# EAGLE design Team_14_PCB_Ver4.5 (EAGLE 8.3.2)
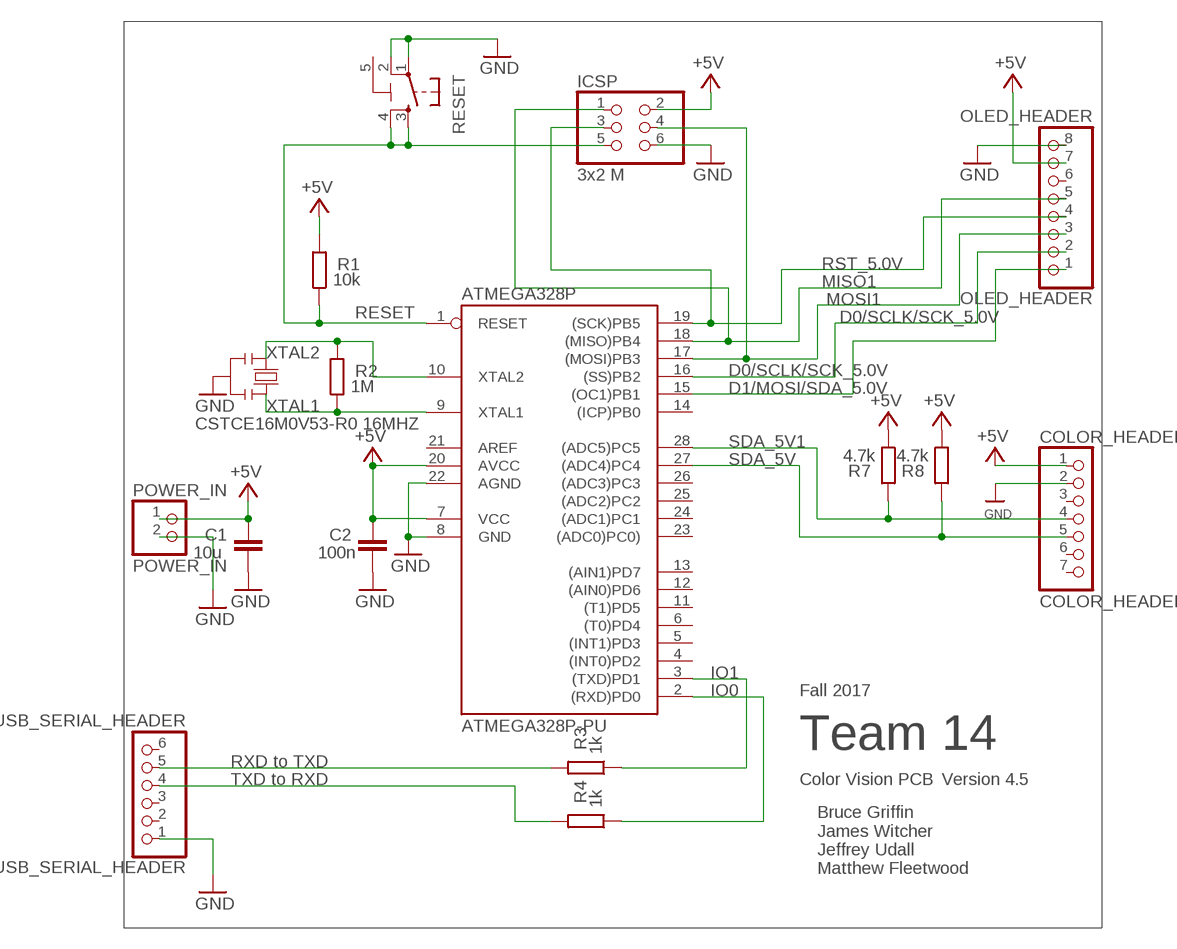
[diagram p0: schematic, sheet 1]

## Parts
ATMEGA328P  ATMEGA328P-PU  [DIL28-3]
C1  10u  C-EU0603-RND  [C0603-ROUND]
C2  100n  C-EU0603-RND  [C0603-ROUND]
COLOR_HEADER  COLOR_HEADER  HEADER-1X770MIL  [1X07_ROUND_70]
ICSP  3x2 M  PINHD-2X3  [2X03]
OLED_HEADER  OLED_HEADER  HEADER-1X870MIL  [1X08_ROUND_70]
POWER_IN  POWER_IN  PINHD-1X2  [1X02]
R1  10k  R-EU_R0603  [R0603-ROUND]
R2  1M  R-EU_R0603  [R0603-ROUND]
R3  1k  R-EU_R0603  [R0603-ROUND]
R4  1k  R-EU_R0603  [R0603-ROUND]
R7  4.7k  R-EU_R0603  [R0603-ROUND]
R8  4.7k  R-EU_R0603  [R0603-ROUND]
RESET  TS42  [TS42]
USB_SERIAL_HEADER  USB_SERIAL_HEADER  PINHD-1X6  [1X06]
Y2  CSTCE16M0V53-R0 16MHZ  RESONATORMU  [RESONATOR]

## Nets
+5V [usbvcc]: ATMEGA328P.7(VCC) ATMEGA328P.20(AVCC) C1.2 C2.2 COLOR_HEADER.1 ICSP.2 OLED_HEADER.7 POWER_IN.1 R1.2 R7.1 R8.1
D0/SCLK/SCK_5.0V: ATMEGA328P.16((SS)PB2) OLED_HEADER.2
D1/MOSI/SDA_5.0V: ATMEGA328P.15((OC1)PB1) OLED_HEADER.1
GND [gnd]: ATMEGA328P.8(GND) ATMEGA328P.22(AGND) C1.1 C2.1 COLOR_HEADER.2 ICSP.6 OLED_HEADER.8 POWER_IN.2 RESET.1 RESET.2 USB_SERIAL_HEADER.1 Y2.2
IO0: ATMEGA328P.2((RXD)PD0) R4.1
IO1: ATMEGA328P.3((TXD)PD1) R3.1
MISO1: ATMEGA328P.18((MISO)PB4) ICSP.1 OLED_HEADER.5
MOSI1: ATMEGA328P.17((MOSI)PB3) ICSP.4 OLED_HEADER.3
N$1: R3.2 USB_SERIAL_HEADER.5
N$2: R4.2 USB_SERIAL_HEADER.4
RESET: ATMEGA328P.1(RESET) ICSP.5 R1.1 RESET.3 RESET.4
RST_5.0V: ATMEGA328P.19((SCK)PB5) ICSP.3 OLED_HEADER.4
SDA_5V: ATMEGA328P.27((ADC4)PC4) COLOR_HEADER.5 R8.2
SDA_5V1: ATMEGA328P.28((ADC5)PC5) COLOR_HEADER.4 R7.2
XTAL1: ATMEGA328P.9(XTAL1) R2.1 Y2.3
XTAL2: ATMEGA328P.10(XTAL2) R2.2 Y2.1
Unconnected: ATMEGA328P.4((INT0)PD2) ATMEGA328P.5((INT1)PD3) ATMEGA328P.6((T0)PD4) ATMEGA328P.11((T1)PD5) ATMEGA328P.12((AIN0)PD6) ATMEGA328P.13((AIN1)PD7) ATMEGA328P.14((ICP)PB0) ATMEGA328P.21(AREF) ATMEGA328P.23((ADC0)PC0)) ATMEGA328P.24((ADC1)PC1) ATMEGA328P.25((ADC2)PC2) ATMEGA328P.26((ADC3)PC3) COLOR_HEADER.3 COLOR_HEADER.6 COLOR_HEADER.7 OLED_HEADER.6 USB_SERIAL_HEADER.2 USB_SERIAL_HEADER.3 USB_SERIAL_HEADER.6

## Notes on the sheet
- Fall 2017
- Team 14
- RXD to TXD
- TXD to RXD | Color Vision PCB | Version 4.5
- Bruce Griffin
  James Witcher
  Jeffrey Udall
  Matthew Fleetwood

## Power pins joined to a net without a drawn wire
5-GND: RESET.5(5-GND)

## Library data of the parts
ATMEGA328P = SmartPrj:ATMEGA328P-: MICROCONTROLLER 4 Kbytes FLASH 128 bytes SRAM 256 bytes EEPROM UART 6-channel 10 bit ADC
C1 C2 = SmartPrj:C-EU: CAPACITOR, European symbol
COLOR_HEADER = microbuilder:HEADER-1X7: PIN HEADER
ICSP = SmartPrj:PINHD-2X3: PIN HEADER
OLED_HEADER = microbuilder:HEADER-1X8: PIN HEADER
POWER_IN = pinhead:PINHD-1X2: PIN HEADER
R1-R4 R7 R8 = SmartPrj:R-EU_: RESISTOR, European symbol
RESET = SmartPrj:TS42: TS42 Dongnan Electronics Tact switch VDC 12V - 50mA
USB_SERIAL_HEADER = adafruit:PINHD-1X6: PIN HEADER
Y2 = SmartPrj:RESONATOR

## Net classes
0 default: width 0.254 mm, drill 0.305 mm, clearance 0.152 mm
1 power: width 0.61 mm, drill 0.61 mm, clearance 0.254 mm
2 gnd: width 0.305 mm, drill 0.559 mm, clearance 0.254 mm
3 usbvcc: width 0.508 mm, drill 0.61 mm, clearance 0.254 mm
4 aref: width 0.406 mm, drill 0.61 mm, clearance 0.254 mm

## Board
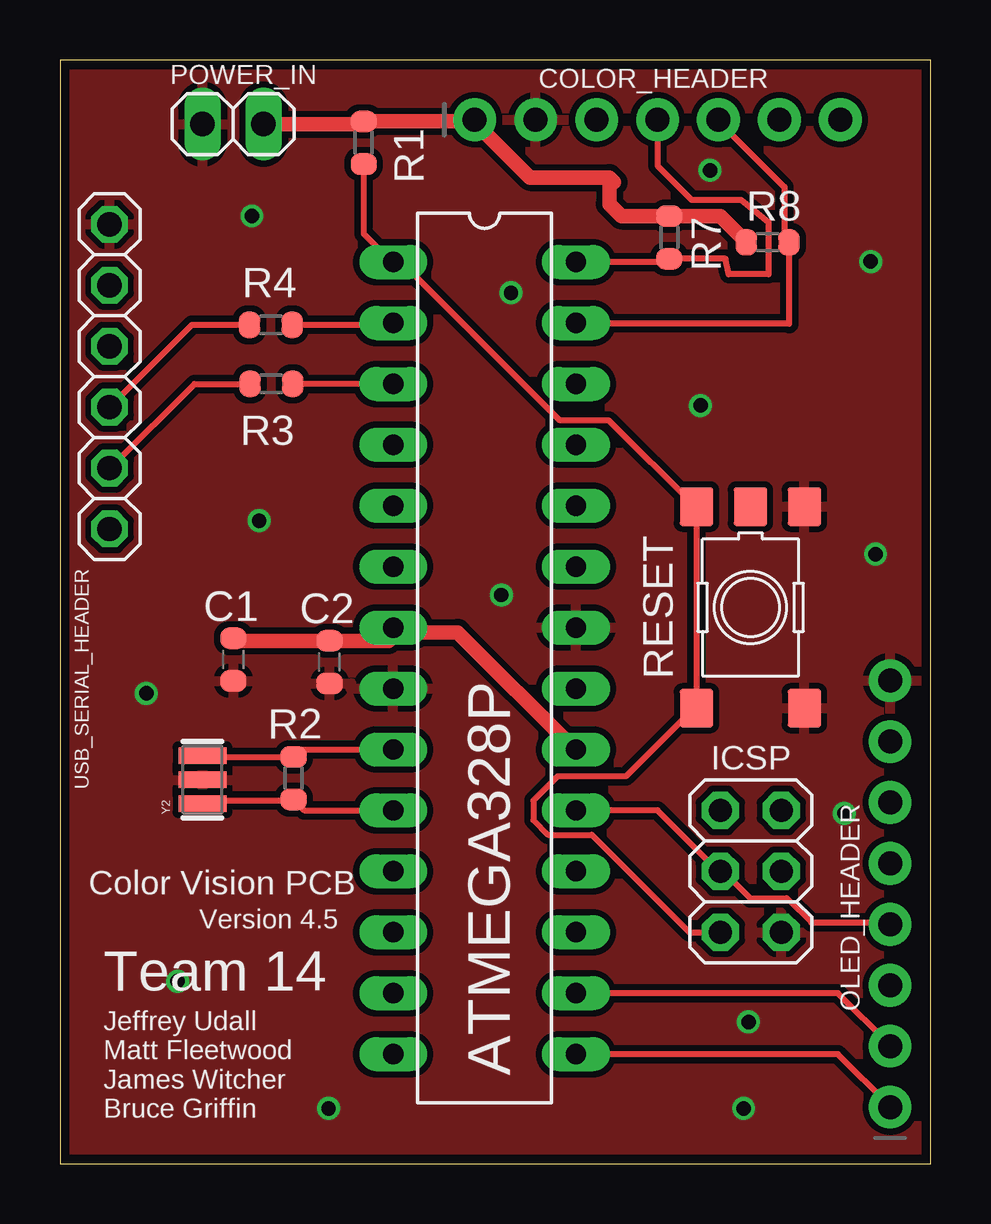
[diagram p1: board, top side]
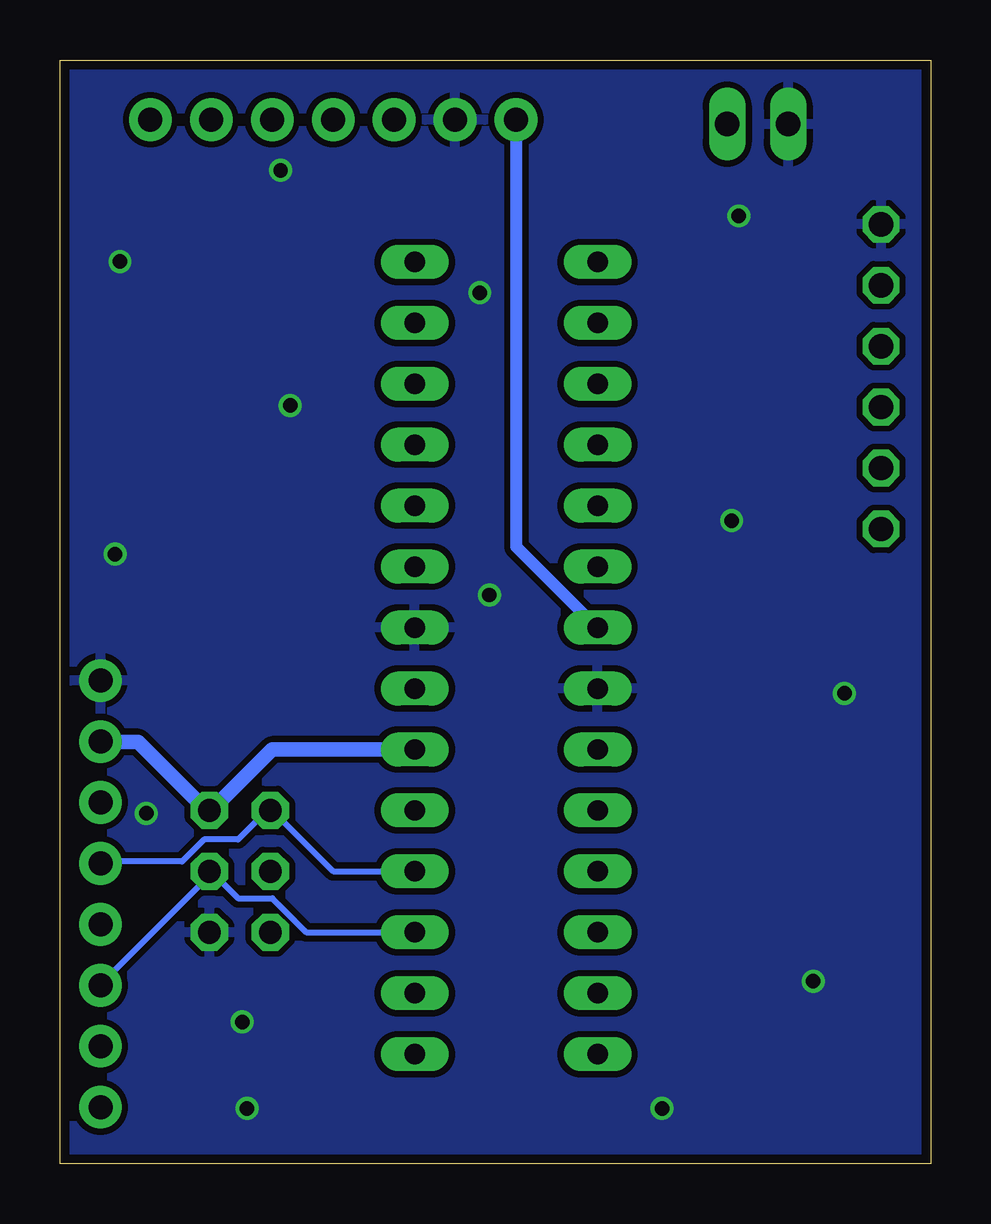
[diagram p2: board, bottom side, seen from below]

Size 36.3 x 46 mm. Coordinates in mm from the lower left corner, seen from the top.
Outline: 0,0 36.3,0 36.3,46 0,46 0,0
Copper layers (1*16): Top 0.0356mm / dielectric 1.5011mm / Bottom 0.0356mm
Design rules "oshpark-2layer": minimum track width 6mil, minimum drill 13mil, track to track 6mil, track to pad 6mil, pad to pad 6mil, via to via 6mil, smd to smd 6mil, copper to edge 15mil, drill to drill 6mil, minimum pad ring 7mil, minimum via ring 7mil, stop-mask expansion 2.5mil, vias tented up to drill 0mil, thermal gap 10mil

### Footprints (pad centres in the part's own frame; a part is rotated, then mirrored left to right if it is on the bottom)
DIL28-3 = drill 0.85 pad 1.422 long: 1 -16.51,-3.81; 2 -13.97,-3.81; 3 -11.43,-3.81; 4 -8.89,-3.81; 5 -6.35,-3.81; 6 -3.81,-3.81; 7 -1.27,-3.81; 8 1.27,-3.81; 9 3.81,-3.81; 10 6.35,-3.81; 11 8.89,-3.81; 12 11.43,-3.81; 13 13.97,-3.81; 14 16.51,-3.81; 15 16.51,3.81; 16 13.97,3.81; 17 11.43,3.81; 18 8.89,3.81; 19 6.35,3.81; 20 3.81,3.81; 21 1.27,3.81; 22 -1.27,3.81; 23 -3.81,3.81; 24 -6.35,3.81; 25 -8.89,3.81; 26 -11.43,3.81; 27 -13.97,3.81; 28 -16.51,3.81
C0603-ROUND = smd 0.898 x 1.1: 1 -0.889,0; 2 0.889,0
1X07_ROUND_70 = drill 1 pad 1.778: 1 -7.62,0; 2 -5.08,0; 3 -2.54,0; 4 0,0; 5 2.54,0; 6 5.08,0; 7 7.62,0
2X03 = drill 0.95 pad 1.55 octagon: 1 -2.54,-1.27; 2 -2.54,1.27; 3 0,-1.27; 4 0,1.27; 5 2.54,-1.27; 6 2.54,1.27
1X08_ROUND_70 = drill 1 pad 1.778: 1 -8.89,0; 2 -6.35,0; 3 -3.81,0; 4 -1.27,0; 5 1.27,0; 6 3.81,0; 7 6.35,0; 8 8.89,0
1X02 = drill 1.016 long: 1 -1.27,0; 2 1.27,0
R0603-ROUND = smd 0.898 x 1.1: 1 -0.889,0; 2 0.889,0
TS42 = smd 1.6 x 1.4: 1 -4.2,2.25; 2 4.2,2.25; 3 -4.2,-2.25; 4 4.2,-2.25; 5 -4.2,0
1X06 = drill 1.016 octagon: 1 -6.35,0; 2 -3.81,0; 3 -1.27,0; 4 1.27,0; 5 3.81,0; 6 6.35,0
RESONATOR = smd 0.7 x 2: 1 -1,0; 2 0,0; 3 1,0

### Placement (x,y rotation side)
ATMEGA328P  17.7,21.07 270 top
C1  7.23,21.01 90 top
C2  11.24,20.9 90 top
COLOR_HEADER  24.91,43.51 0 top
ICSP  28.8,12.18 270 top
OLED_HEADER  34.61,11.24 90 top
POWER_IN  7.21,43.33 180 top
R1  12.66,42.55 90 top
R2  9.74,16.06 270 top
R3  8.81,32.5 180 top
R4  8.79,34.96 180 top
R7  25.4,38.6 270 top
R8  29.5,38.4 0 top
RESET  28.79,23.18 270 top
USB_SERIAL_HEADER  2.07,32.8 270 top
Y2  5.94,16 90 top

### Tracks (layer width: path | path; a pad name or v marks a point on that pad's centre or on a via)
+5V
  Top 0.508: 17.19,43.47 COLOR_HEADER.1 | 14.04,22.14 ATMEGA328P.7 | 21.46,17.26 ATMEGA328P.20
  Top 0.61: 21.46,17.26 16.58,22.14 14.04,22.14 13.7,21.79 C2.2 7.34,21.79 C1.2 | POWER_IN.1 12.55,43.33 R1.2 17.16,43.44 17.19,43.47 | COLOR_HEADER.1 17.29,43.41 19.6,41.1 22.9,41.1 | 22.9,41.1 23.1,40.9 | 22.9,41.1 22.9,40 23.4,39.5 25.39,39.5 R7.1 27.52,39.49 R8.1
  Bottom 0.508: 29.99,14.72 ICSP.2 30.3,14.82 | 34.57,17.57 OLED_HEADER.7 | COLOR_HEADER.1 17.27,43.48 17.27,25.7 13.92,22.35 ATMEGA328P.7
  Bottom 0.61: ATMEGA328P.20 27.45,17.26 29.99,14.72 | 34.57,17.57 33.04,17.57 30.3,14.82
D0/SCLK/SCK_5.0V
  Top 0.254: ATMEGA328P.16 32.43,7.1 34.57,4.97 OLED_HEADER.2
D1/MOSI/SDA_5.0V
  Top 0.254: ATMEGA328P.15 32.43,4.56 34.57,2.43 OLED_HEADER.1
GND  (via drill 0.6)
  other vias: 27.1,41.4 33.8,37.6 34,25.4 26.7,31.6 18.4,23.7 8.3,26.8 8,39.5 3.6,19.6 11.2,2.3 28.5,2.3 28.7,5.9 32.7,14.6 4.9,7.6 18.8,36.3
  pour Top: 0.2,45.8 36.1,45.8 36.1,0.2 0.2,0.2
  pour Bottom: 0.2,45.8 36.1,45.8 36.1,0.2 0.2,0.2
IO0
  Top 0.254: R4.1 13.81,34.96 ATMEGA328P.2
IO1
  Top 0.254: ATMEGA328P.3 R3.1
MISO1
  Bottom 0.254: ATMEGA328P.18 24.91,12.18 27.45,14.72 ICSP.1 27.66,14.72 28.88,13.5 30.3,13.5 31.21,12.59 34.57,12.59 OLED_HEADER.5
MOSI1
  Bottom 0.254: ATMEGA328P.17 26.03,9.64 27.45,11.06 28.88,11.06 29.99,12.18 ICSP.4 29.99,12.08 34.57,7.51 OLED_HEADER.3
N$1
  Top 0.254: R3.2 5.61,32.5 2.15,29.05 USB_SERIAL_HEADER.5
N$2
  Top 0.254: USB_SERIAL_HEADER.4 5.5,34.96 R4.2
RESET
  Top 0.254: 13.84,37.58 ATMEGA328P.1 13.94,37.48 | ICSP.5 26.23,9.64 22.17,13.7 20.34,13.7 19.73,14.31 19.73,15.13 20.75,16.14 23.59,16.14 26.44,18.99 RESET.4 26.54,27.32 RESET.3 26.44,27.42 22.88,30.98 20.85,30.98 14.35,37.48 13.94,37.48 | R1.1 12.66,38.76 13.94,37.48
RST_5.0V
  Top 0.254: ATMEGA328P.19 24.91,14.72 27.45,12.18 ICSP.3 27.66,12.18 28.77,11.06 30.3,11.06 31.31,10.05 34.57,10.05 OLED_HEADER.4
SDA_5V
  Top 0.254: 21.66,35.14 21.56,35.04 ATMEGA328P.27 30.36,35.04 30.4,35 R8.2 30.2,38.59 30.2,40.7 27.45,43.45 COLOR_HEADER.5 27.45,43.47 27.55,43.37
SDA_5V1
  Top 0.254: 21.66,37.68 21.56,37.58 ATMEGA328P.28 25.27,37.58 R7.2 27.74,37.71 27.88,37.07 29.54,37.07 29.54,39.23 28.39,40.17 26.32,40.17 24.91,41.59 COLOR_HEADER.4 24.91,43.47 25.02,43.37
XTAL1
  Top 0.254: Y2.3 6.02,16.95 9.67,16.95 R2.1 9.78,17.06 9.98,17.26 ATMEGA328P.9
XTAL2
  Top 0.254: Y2.1 6.02,15.03 6.12,15.13 9.67,15.13 R2.2 9.78,15.13 10.18,14.72 ATMEGA328P.10

### Text on the board
tNames: Color Vision PCB | Version 4.5 | Team 14 | Jeffrey Udall / Matt Fleetwood / James Witcher / Bruce Griffin